# EAGLE design ReflowController (EAGLE 6.3)
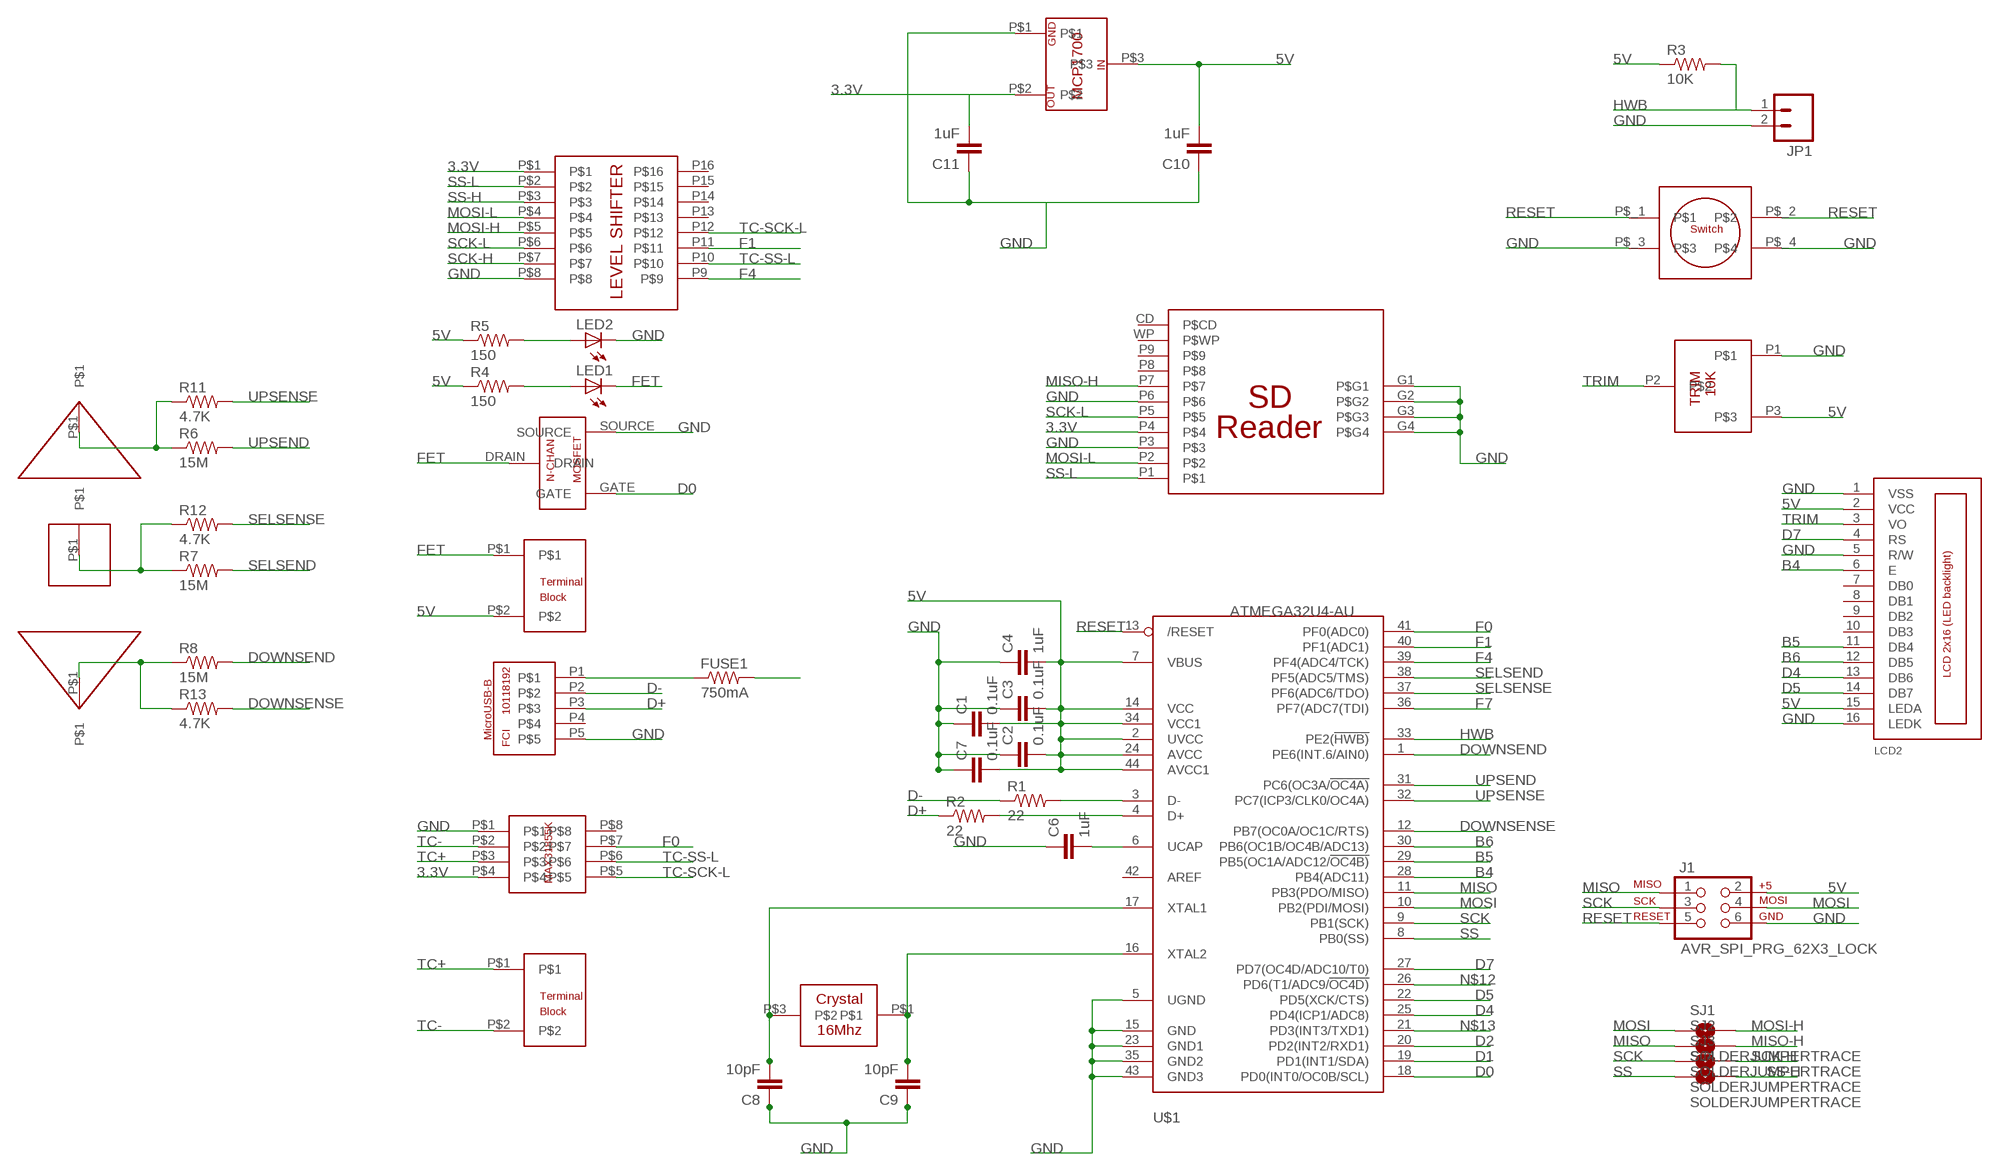
[diagram p0: schematic, sheet 1]

## Parts
C1  0.1uF  CAP0603-CAP  [0603-CAP]
C2  0.1uF  CAP0603-CAP  [0603-CAP]
C3  0.1uF  CAP0603-CAP  [0603-CAP]
C4  1uF  CAP0603-CAP  [0603-CAP]
C6  1uF  CAP0603-CAP  [0603-CAP]
C7  0.1uF  CAP0603-CAP  [0603-CAP]
C8  10pF  CAP0603-CAP  [0603-CAP]
C9  10pF  CAP0603-CAP  [0603-CAP]
C10  1uF  CAP0603-CAP  [0603-CAP]
C11  1uF  CAP0603-CAP  [0603-CAP]
FUSE1  750mA  RESISTOR0603-RES  [0603-RES]
J1  AVR_SPI_PRG_62X3_LOCK  [2X3_LOCK]
JP1  M02PTH  [1X02]
LCD2  LCD_2X16_SIL  [HY-1602F]
LED1  LED0603  [LED-0603]
LED2  LED0603  [LED-0603]
R1  22  RESISTOR0603-RES  [0603-RES]
R2  22  RESISTOR0603-RES  [0603-RES]
R3  10K  RESISTOR0603-RES  [0603-RES]
R4  150  RESISTOR0603-RES  [0603-RES]
R5  150  RESISTOR0603-RES  [0603-RES]
R6  15M  RESISTOR0603-RES  [0603-RES]
R7  15M  RESISTOR0603-RES  [0603-RES]
R8  15M  RESISTOR0603-RES  [0603-RES]
R11  4.7K  RESISTOR0603-RES  [0603-RES]
R12  4.7K  RESISTOR0603-RES  [0603-RES]
R13  4.7K  RESISTOR0603-RES  [0603-RES]
SJ1  SOLDERJUMPERTRACE  [SJ_2S-TRACE]
SJ2  SOLDERJUMPERTRACE  [SJ_2S-TRACE]
SJ3  SOLDERJUMPERTRACE  [SJ_2S-TRACE]
SJ4  SOLDERJUMPERTRACE  [SJ_2S-TRACE]
U$1  ATMEGA32U4-AU  [TQFP44]
U$2  16MHZ-CRYSTAL_NX3225GA-16.000M-STD-CRG-1  [16MHZ-CRYSTAL_NX3225GA-16.000M-STD-CRG-1]
U$3  USB-B_10118192-0001LF  [USB-B_10118192-0001LF]
U$4  SDREADER_2041021-4  [SDREADER_2041021-4]
U$5  2POS_TERM_ED2748-ND  [2POS_TERM_ED2748-ND]
U$6  N-MOSFET630_DMG1012T-7DICT-ND  [N-MOSFET630_DMG1012T-7DICT-ND]
U$7  2POS_TERM_ED2748-ND  [2POS_TERM_ED2748-ND]
U$8  NXP_LVL_SHIFT_74HC4050D,653  [NXP_LVL_SHIFT_74HC4050D,653]
U$9  MAX_TC_MAX31855KASA+  [MAX_TC_MAX31855KASA+]
U$10  10K_TRIM_3362F-1-103LF  [10K_TRIM_3362F-1-103LF]
U$11  MCP1700__LDO  [MCP1700__LDO]
U$12  MOM-SWITCH-EG4620CT-ND  [MOM-SWITCH-EG4620CT-ND]
U$13  CAPTOUCH_ARROW  [CAPTOUCH_ARROW]
U$14  CAPTOUCH_ARROW  [CAPTOUCH_ARROW]
U$15  CAPTOUCH_SQUARE  [CAPTOUCH_SQUARE]

## Nets
3.3V: C11.2 U$4.P4 U$8.P$1 U$9.P$4 U$11.P$2
5V: C1.2 C2.2 C3.2 C4.2 C7.2 C10.2 FUSE1.2 J1.2 LCD2.2(VCC) LCD2.15(LEDA) R3.1 R4.1 R5.1 U$1.2(UVCC) U$1.7(VBUS) U$1.14(VCC) U$1.24(AVCC) U$1.34(VCC1) U$1.44(AVCC1) U$5.P$2 U$10.P3 U$11.P$3
B4: LCD2.6(E) U$1.28(PB4(ADC11))
B5: LCD2.11(DB4) U$1.29(PB5(OC1A/ADC12/!OC4B))
B6: LCD2.12(DB5) U$1.30(PB6(OC1B/OC4B/ADC13))
D0: U$1.18(PD0(INT0/OC0B/SCL)) U$6.GATE
D1: U$1.19(PD1(INT1/SDA))
D2: U$1.20(PD2(INT2/RXD1))
D4: LCD2.13(DB6) U$1.25(PD4(ICP1/ADC8))
D5: LCD2.14(DB7) U$1.22(PD5(XCK/CTS))
D7: LCD2.4(RS) U$1.27(PD7(OC4D/ADC10/T0))
D+: R2.1 U$3.P3
D-: R1.1 U$3.P2
DOWNSEND: R8.2 U$1.1(PE6(INT.6/AIN0))
DOWNSENSE: R13.2 U$1.12(PB7(OC0A/OC1C/RTS))
F0: U$1.41(PF0(ADC0)) U$9.P$7
F1: U$1.40(PF1(ADC1)) U$8.P11
F4: U$1.39(PF4(ADC4/TCK)) U$8.P9
F7: U$1.36(PF7(ADC7(TDI))
FET: LED1.C U$5.P$1 U$6.DRAIN
GND: C1.1 C2.1 C3.1 C4.1 C6.1 C7.1 C8.1 C9.1 C10.1 C11.1 J1.6 JP1.2 LCD2.1(VSS) LCD2.5(R/W) LCD2.16(LEDK) LED2.C U$1.5(UGND) U$1.15(GND) U$1.23(GND1) U$1.35(GND2) U$1.43(GND3) U$3.P5 U$4.G1(P$G1) U$4.G2(P$G2) U$4.G3(P$G3) U$4.G4(P$G4) U$4.P3 U$4.P6 U$6.SOURCE U$8.P$8 U$9.P$1 U$10.P1 U$11.P$1 U$12.P$_3 U$12.P$_4
HWB: JP1.1 R3.2 U$1.33(PE2(!HWB))
MISO: J1.1 SJ2.1 U$1.11(PB3(PDO/MISO))
MISO-H: SJ2.2 U$4.P7
MOSI: J1.4 SJ1.1 U$1.10(PB2(PDI/MOSI))
MOSI-H: SJ1.2 U$8.P$5
MOSI-L: U$4.P2 U$8.P$4
N$1: C8.2 U$1.17(XTAL1) U$2.P$3
N$2: C9.2 U$1.16(XTAL2) U$2.P$1
N$3: LED1.A R4.2
N$4: LED2.A R5.2
N$5: FUSE1.1 U$3.P1
N$7: R1.2 U$1.3(D-)
N$8: C6.2 U$1.6(UCAP)
N$9: R2.2 U$1.4(D+)
N$12: U$1.26(PD6(T1/ADC9/!OC4D))
N$13: U$1.21(PD3(INT3/TXD1))
N$15: R6.1 R11.1 U$13.P$1
N$16: R7.1 R12.1 U$15.P$1
N$17: R8.1 R13.1 U$14.P$1
RESET: J1.5 U$1.13(/RESET) U$12.P$_1 U$12.P$_2
SCK: J1.3 SJ3.1 U$1.9(PB1(SCK))
SCK-H: SJ3.2 U$8.P$7
SCK-L: U$4.P5 U$8.P$6
SELSEND: R7.2 U$1.38(PF5(ADC5/TMS))
SELSENSE: R12.2 U$1.37(PF6(ADC6/TDO))
SS: SJ4.1 U$1.8(PB0(SS))
SS-H: SJ4.2 U$8.P$3
SS-L: U$4.P1 U$8.P$2
TC+: U$7.P$1 U$9.P$3
TC-: U$7.P$2 U$9.P$2
TC-SCK-L: U$8.P12 U$9.P$5
TC-SS-L: U$8.P10 U$9.P$6
TRIM: LCD2.3(VO) U$10.P2
UPSEND: R6.2 U$1.31(PC6(OC3A/!OC4A))
UPSENSE: R11.2 U$1.32(PC7(ICP3/CLK0/OC4A))
Unconnected: LCD2.7(DB0) LCD2.8(DB1) LCD2.9(DB2) LCD2.10(DB3) U$1.42(AREF) U$3.P4 U$4.CD(P$CD) U$4.P8 U$4.P9 U$4.WP(P$WP) U$8.P13 U$8.P14 U$8.P15 U$8.P16 U$9.P$8

## Library data of the parts
C1-C4 C6-C11 = SparkFun-Capacitors:CAP: Capacitor Standard 0603 ceramic capacitor, and 0.1" leaded capacitor.
FUSE1 R1-R8 R11-R13 = SparkFun-Passives:RESISTOR: Resistor Basic schematic elements and footprints for 0603, 1206, and PTH resistors.
J1 = SparkFun-Connectors:AVR_SPI_PRG_6: AVR ISP 6 Pin This is the reduced ISP connector for AVR programming. Common on Arduino. This footprint will take up less PCB space and can be used with a 10-pin to 6-pin adapter such as SKU: BOB-08508
JP1 = SparkFun-Connectors:M02: Header 2 Standard 2-pin 0.1" header. Use with straight break away headers (SKU : PRT-00116), right angle break away headers (PRT-00553), swiss pins (PRT-00743), machine pins (PRT-00117), and female headers (PRT-00115). Molex polarized connector foot print use with SKU : PRT-08233 with associated crimp pins and housings.
LCD2 = lcd_2x16_led_backlight:LCD_2X16_SIL
LED1 LED2 = SparkFun-LED:LED: LEDs Standard schematic elements and footprints for 5mm, 3mm, 1206, and 0603 sized LEDs. 5mm - Spark Fun Electronics SKU : COM-00529 (and others)
SJ1-SJ4 = SparkFun-Passives:SOLDERJUMPER: Solder Jumper Standard SMD solder jumper. Used to automate production. Two varients : Normally Open and Normally Closed are the same, but have different paste layers. NC will have a large amount of paste and should jumper during reflow.
U$1 = adafruit:ATMEGA32U4: http://www.ladyada.net/library/eagle
U$2 = JKCustom:16MHZ-CRYSTAL_NX3225GA-16.000M-STD-CRG-1
U$3 = JKCustom:USB-B_10118192-0001LF
U$4 = JKCustom:SDREADER_2041021-4
U$5 U$7 = JKCustom:2POS_TERM_ED2748-ND
U$6 = JKCustom:N-MOSFET630_DMG1012T-7DICT-ND
U$8 = JKCustom:NXP_LVL_SHIFT_74HC4050D,653
U$9 = JKCustom:MAX_TC_MAX31855KASA+
U$10 = JKCustom:10K_TRIM_3362F-1-103LF
U$11 = JKCustom:MCP1700__LDO
U$12 = JKCustom:MOM-SWITCH-EG4620CT-ND
U$13 U$14 = JKCustom:CAPTOUCH_ARROW
U$15 = JKCustom:CAPTOUCH_SQUARE

## Board
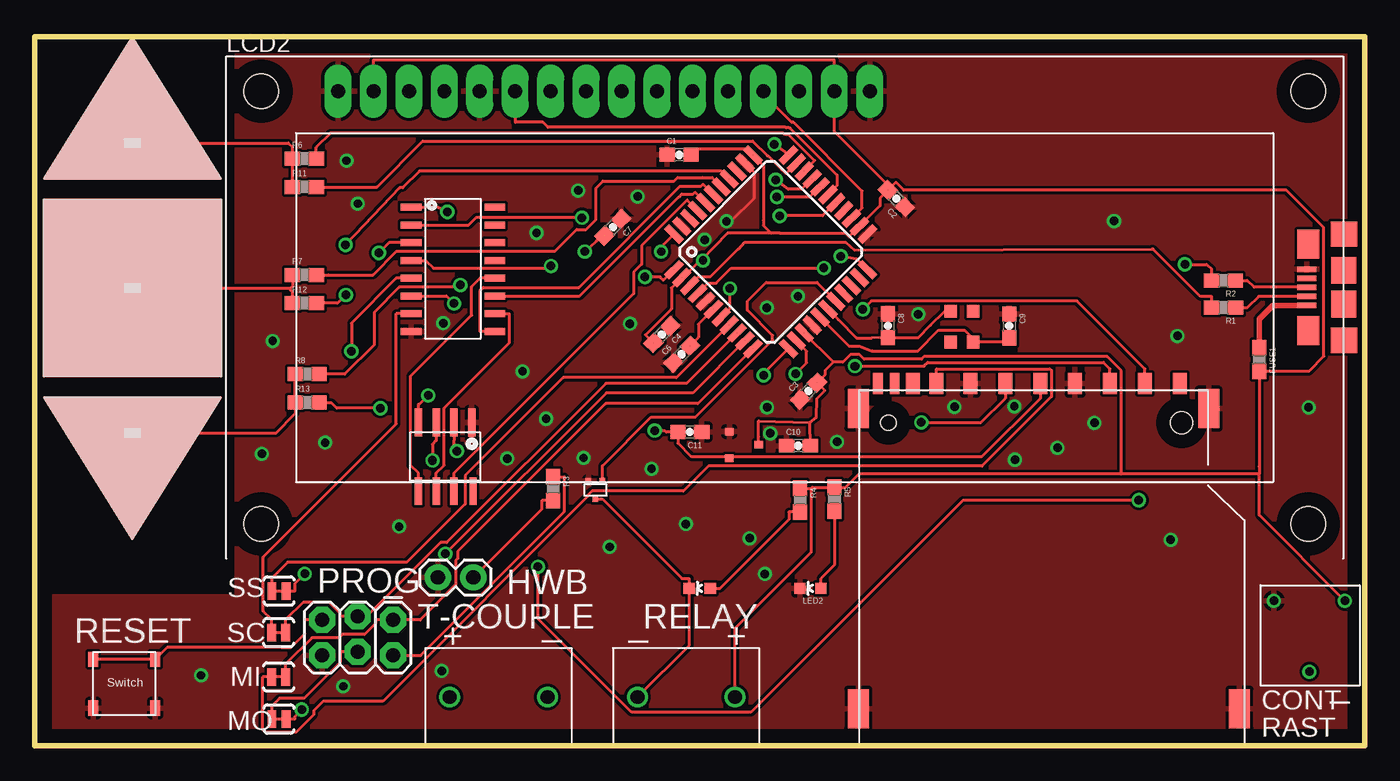
[diagram p1: board, top side]
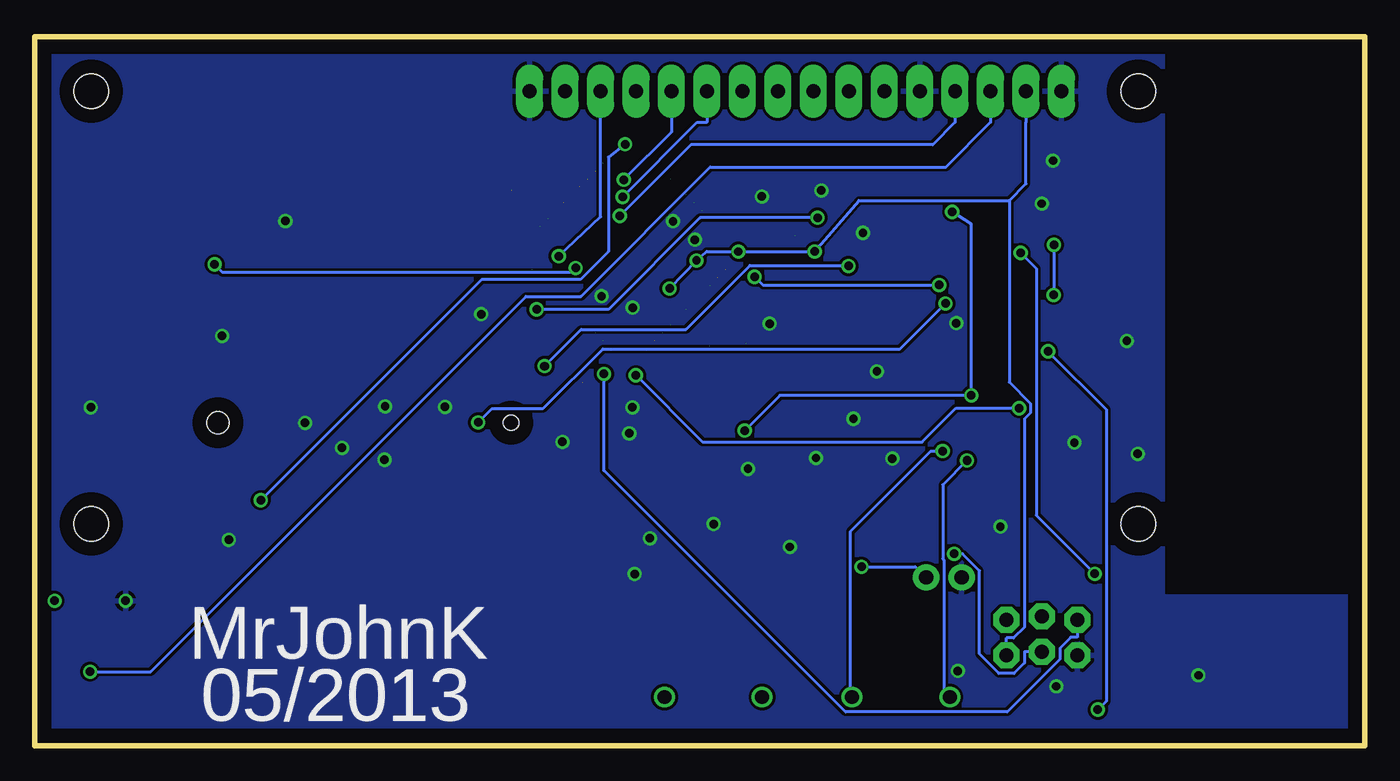
[diagram p2: board, bottom side, seen from below]

Size 95.25 x 50.8 mm. Coordinates in mm from the lower left corner, seen from the top.
Outline: 95.25,0 95.25,50.8 0,50.8 0,0 95.25,0
Copper layers (1*16): Top 0.035mm / dielectric 1.5mm / Bottom 0.035mm
Design rules "default *": minimum track width 8mil, minimum drill 24mil, track to track 8mil, track to pad 8mil, pad to pad 8mil, via to via 8mil, smd to smd 8mil, copper to edge 40mil, drill to drill 8mil, minimum pad ring 8mil, minimum via ring 8mil, stop-mask expansion 4mil, vias tented up to drill 0mil, thermal gap 10mil

### Footprints (pad centres in the part's own frame; a part is rotated, then mirrored left to right if it is on the bottom)
0603-CAP = smd 1.1 x 1: 1 -0.85,0; 2 0.85,0
0603-RES = smd 1.1 x 1: 1 -0.85,0; 2 0.85,0
2X3_LOCK = drill 1.016 pad 1.88 octagon: 1 0,0; 2 0,2.54; 3 2.54,-0.254; 4 2.54,2.286; 5 5.08,0; 6 5.08,2.54
1X02 = drill 1.016 pad 1.88: 1 0,0; 2 2.54,0
HY-1602F = drill 1 pad 1.93 long: 1 2.54,0; 2 5.08,0; 3 7.62,0; 4 10.16,0; 5 12.7,0; 6 15.24,0; 7 17.78,0; 8 20.32,0; 9 22.86,0; 10 25.4,0; 11 27.94,0; 12 30.48,0; 13 33.02,0; 14 35.56,0; 15 38.1,0; 16 40.64,0 | hole 2.5: -2.96,0; 72.04,0; -2.96,-31; 72.04,-31
LED-0603 = smd 0.8 x 0.8: A 0,-0.75; C 0,0.75
SJ_2S-TRACE = smd 0.635 x 1.27: 1 -0.508,0; 2 0.508,0
TQFP44 = smd 1.5 x 0.5: 1 -5.8,4; 2 -5.8,3.2; 3 -5.8,2.4; 4 -5.8,1.6; 5 -5.8,0.8; 6 -5.8,0; 7 -5.8,-0.8; 8 -5.8,-1.6; 9 -5.8,-2.4; 10 -5.8,-3.2; 11 -5.8,-4; 23 5.8,-4; 24 5.8,-3.2; 25 5.8,-2.4; 26 5.8,-1.6; 27 5.8,-0.8; 28 5.8,0; 29 5.8,0.8; 30 5.8,1.6; 31 5.8,2.4; 32 5.8,3.2; 33 5.8,4 | smd 0.5 x 1.5: 12 -4,-5.8; 13 -3.2,-5.8; 14 -2.4,-5.8; 15 -1.6,-5.8; 16 -0.8,-5.8; 17 0,-5.8; 18 0.8,-5.8; 19 1.6,-5.8; 20 2.4,-5.8; 21 3.2,-5.8; 22 4,-5.8; 34 4,5.8; 35 3.2,5.8; 36 2.4,5.8; 37 1.6,5.8; 38 0.8,5.8; 39 0,5.8; 40 -0.8,5.8; 41 -1.6,5.8; 42 -2.4,5.8; 43 -3.2,5.8; 44 -4,5.8
16MHZ-CRYSTAL_NX3225GA-16.000M-STD-CRG-1 = smd 0.9 x 0.9: P$1 -1.1,-0.8; P$3 1.1,0.8; P$NC_2 1.1,-0.8; P$NC_4 -1.1,0.8
USB-B_10118192-0001LF = smd 0.4 x 1.35: P1 -1.3,2.65; P2 -0.65,2.65; P3 0,2.65; P4 0.65,2.65; P5 1.3,2.65 | smd 1.8 x 1.9: P$1_NC -3.8,0; P$2_NC 3.8,0 | smd 1.9 x 1.8: P$3_NC -1.2,0; P$4_NC 1.2,0 | smd 2.1 x 1.6: P$5_NC -3.1,2.55; P$6_NC 3.1,2.55
SDREADER_2041021-4 = smd 0.7 x 1.5: CD -11.05,24.7; WP -12.25,24.7 | smd 1.5 x 2.8: G1 11.45,22.9; G2 13.65,1.4; G3 -13.65,1.4; G4 -13.65,22.9 | smd 1 x 1.5: P1 6.875,24.7; P2 4.375,24.7; P3 1.875,24.7; P4 -0.625,24.7; P5 -3.125,24.7; P6 -5.625,24.7; P7 -8.05,24.7; P8 -9.75,24.7; P9 9.375,24.7 | hole 1.1: -11.5,21.9 | hole 1.6: 9.5,21.9
2POS_TERM_ED2748-ND = drill 1: P$1 0,0; P$2 7,0
N-MOSFET630_DMG1012T-7DICT-ND = smd 0.4 x 0.4: DRAIN 0,1.3; GATE -0.5,0; SOURCE 0.5,0
NXP_LVL_SHIFT_74HC4050D,653 = smd 0.5 x 1.5: P9 8.89,6; P10 7.62,6; P11 6.35,6; P12 5.08,6; P13 3.81,6; P14 2.54,6; P15 1.27,6; P16 0,6; P$1 0,0; P$2 1.27,0; P$3 2.54,0; P$4 3.81,0; P$5 5.08,0; P$6 6.35,0; P$7 7.62,0; P$8 8.89,0
MAX_TC_MAX31855KASA+ = smd 1.98 x 0.53: P$1 0,0; P$2 0,-1.27; P$3 0,-2.54; P$4 0,-3.81; P$5 4.93,-3.81; P$6 4.93,-2.54; P$7 4.93,-1.27; P$8 4.93,0.1
10K_TRIM_3362F-1-103LF = drill 0.6: P1 -2.54,5.08; P2 0,0; P3 2.54,5.08
MCP1700__LDO = smd 0.54 x 0.62: P$1 0,0; P$2 1.9,0; P$3 0.95,2.1
MOM-SWITCH-EG4620CT-ND = smd 0.7 x 1.1: P$_1 -2.225,3.95; P$_2 2.225,3.95; P$_3 -2.225,0.45; P$_4 2.225,0.45
CAPTOUCH_ARROW = smd 1.27 x 0.635: P$1 0,2.54
CAPTOUCH_SQUARE = smd 1.27 x 0.635: P$1 0,0

### Placement (x,y rotation side)
C1  46.15,42.34 0 top
C2  61.71,39.2 135 top
C3  55.42,25.4 45 top
C4  44.91,29.46 225 top
C6  46.33,28.04 45 top
C7  41.4,37.14 225 top
C8  61.1,30.09 270 top
C9  69.79,30.07 270 top
C10  54.7,21.49 0 top
C11  46.92,22.47 180 top
FUSE1  87.71,27.66 270 top
J1  25.66,9.01 180 top
JP1  31.41,12.05 180 top
LCD2  19.17,46.89 0 top
LED1  47.62,11.27 90 top
LED2  55.56,11.27 90 top
R1  85.15,31.39 180 top
R2  85.14,33.33 180 top
R3  37.12,18.41 270 top
R4  54.82,17.59 270 top
R5  57.27,17.66 270 top
R6  19.3,42.06 0 top
R7  19.3,33.73 0 top
R8  19.51,26.62 0 top
R11  19.3,40.03 0 top
R12  19.3,31.7 0 top
R13  19.51,24.59 0 top
SJ1  17.49,1.91 0 top
SJ2  17.46,4.92 180 top
SJ3  17.46,8.1 180 top
SJ4  17.49,11.08 0 top
U$1  52.7,35.37 45 top
U$2  66.41,30.02 90 top
U$3  93.77,32.84 90 top
U$4  72.64,1.24 0 top
U$5  43.15,3.48 0 top
U$6  40.15,18.96 180 top
U$7  29.71,3.48 0 top
U$8  26.94,38.57 270 top
U$9  31.29,23.16 270 top
U$10  91.3,5.3 0 top
U$11  49.74,22.51 270 top
U$12  6.4,2.24 0 top
U$13  6.99,40.64 0 top
U$14  6.99,24.94 180 top
U$15  6.99,32.79 0 top

### Tracks (layer width: path | path; a pad name or v marks a point on that pad's centre or on a via)
3.3V  (via drill 0.61 pad 1.02)
  Top 0.203: v44.4,22.58 45.11,22.58 45.21,22.47 C11.2 46.06,21.67 47.05,20.68 49.74,20.68 | 49.74,20.68 67.81,20.68 72.01,24.89 U$4.P4 | U$11.P$2 49.74,20.68 | U$8.P$1 28,38.57 28.7,38.61 v29.55,38.25 | U$9.P$4 27.48,24.45 27.54,24.45 v28.18,25.09
  Bottom 0.203: v44.4,22.58 41.89,25.09 v28.18,25.09 28.18,37.39 v29.55,38.25
5V  (via drill 0.6, 0.61 pad 1.02)  (8 unrouted)
  Top 0.203: U$10.P3 87.69,16.52 87.69,19.45 | 87.69,19.45 77.81,19.45 | 57.2,27.48 U$1.14 | 77.81,19.45 59.02,19.45 58.08,18.51 R5.1 55.7,18.51 55.62,18.44 | 77.81,19.45 77.81,26.87 76.82,27.87 63.67,27.87 63.51,27.7 59.39,27.7 59.08,28.01 58.41,28.01 57.88,27.48 | 57.88,27.48 | 57.88,27.48 57.2,27.48 | 55.53,23.14 55.98,23.51 56.02,24.87 56.59,25.43 C3.2 56.62,26.61 56.62,26.91 57.2,27.48 | C10.2 55.53,23.14 | U$11.P$3 51.84,22.13 51.84,23.26 55.53,23.14 | R3.1 37.93,19.26 37.93,16.77 27.63,6.47 J1.2 | 60.54,39.23 | 60.54,39.23 60.54,38.68 U$1.24 58.32,36.47 58.06,36.72 53.37,36.72 52.73,36.72 | C7.2 40.45,36.44 40.22,36.17 v39.39,35.4 | LCD2.2 24.25,49.13 57.27,49.13 LCD2.15 57.27,44 61.29,39.98 | 61.29,39.98 61.68,40.37 62.24,39.8 89.66,39.8 92.32,37.13 92.34,27.9 91.25,26.82 FUSE1.2 87.69,26.8 87.69,20 87.69,19.45 | 61.29,39.98 C2.2 60.54,39.23 | U$5.P$2 50.15,8.41 55.62,13.88 55.62,18.44 | R4.1 55.62,18.44 | C4.2 43.74,29.43 45.59,31.29 45.59,32.79 U$1.2 46.44,33.53 47.69,34.78 v47.85,34.77 | C1.2 47.14,42.33 47.55,42.75 50.98,42.75 U$1.34 52.17,41.56 52.17,37.64 52.19,37.64 52.19,37.27 52.73,36.72 | 52.73,36.72 49.62,36.72 47.74,34.78 | U$1.7 49.78,31.32 v49.78,32.77 | U$1.44 44.86,35.73 v44.86,35.4
  Bottom 0.203: 25.45,39.06 25.45,26.04 23.93,24.51 23.93,23.84 24.36,23.41 24.36,8.49 25.14,7.71 25.66,7.71 J1.2 | 25.45,39.06 36.24,39.06 v39.39,35.4 44.45,35.4 | 25.45,39.06 24.25,40.27 24.25,44.66 LCD2.2 | v44.86,35.4 44.45,35.4 | v44.86,35.4 44.45,35.4 | v49.78,32.77 v49.77,32.77 v47.85,34.77 47.14,35.4 v44.86,35.4
B4
  Top 0.203: LCD2.6 34.41,44.66 36.39,44.66 36.74,44.3 53.77,44.3 53.8,44.26 54.02,44.26 54.03,44.25 54.1,44.25 57.29,41.06 57.46,40.88 57.46,40.14 U$1.28
B5  (via drill 0.61 pad 1.02)  (1 unrouted)
  Top 0.203: v53.15,39.31 55.47,39.31 55.49,39.3 U$1.29
  Bottom 0.203: v53.15,39.31 47.81,44.66 47.11,44.66 LCD2.11
B6  (via drill 0.61 pad 1.02)  (1 unrouted)
  Top 0.203: U$1.30 54.93,39.86 53.98,39.86 v53.07,40.55
  Bottom 0.203: LCD2.12 49.65,43.97 v53.07,40.55
D0
  Top 0.203: U$6.GATE 40.65,20.05 44.15,23.54 47.31,23.54 52.84,29.07 52.84,29.39 51.03,31.2 51.03,31.85 52.37,33.18 56.02,33.18 U$1.18
D4  (1 unrouted)
  Top 0.203: U$1.25 59.25,38.52 59.25,39.74 54.33,44.66 54.2,44.66 52.19,46.67 LCD2.13
D5  (via drill 0.61 pad 1.02)  (1 unrouted)
  Top 0.203: U$1.22 58.89,34.85 58.82,34.86 v57.73,35.07
  Bottom 0.203: v57.73,35.07 54.73,37.89 LCD2.14
D7  (via drill 0.61 pad 1.02)  (1 unrouted)
  Top 0.203: U$1.27 56.42,37.96 v53.36,37.96
  Bottom 0.203: v53.36,37.96 v53.35,37.96 48.27,43.05 30.94,43.05 29.33,44.66 LCD2.4
D+
  Top 0.203: R2.1 86.84,33.33 87.33,32.84 U$3.P3
D-
  Top 0.203: R1.1 86.85,31.39 87.65,32.19 U$3.P2
DOWNSEND  (via drill 0.61 pad 1.02)  (1 unrouted)
  Top 0.203: U$1.1 45.03,33.36 44.79,33.59 v43.7,33.59 | v30.47,33 30.32,32.84 26.1,32.84 24.31,31.05 24.31,28.72 22.2,26.62 R8.2
  Bottom 0.203: v43.7,33.59 43.11,33 v30.47,33
DOWNSENSE  (via drill 0.61 pad 1.02)  (1 unrouted)
  Top 0.203: R13.2 21.21,24.59 21.62,24.18 v24.74,24.18 | U$1.12 52.2,26.67 v52.2,26.54
  Bottom 0.203: v52.2,26.54 47.41,21.75 31.7,21.75 29.27,24.18 v24.74,24.18
F0  (1 unrouted)
  Top 0.203: U$1.41 46.72,39.09 43.45,35.82 43.45,34.5 42.88,33.93 42.88,32.39 30.02,19.52 U$9.P$7
F1  (1 unrouted)
  Top 0.203: U$8.P11 39.03,32.22 46.12,39.32 46.33,39.52 47.15,39.52 47.29,39.66 U$1.40
F4  (1 unrouted)
  Top 0.203: U$1.39 47.85,40.22 47.71,40.08 46.21,40.08 38.96,32.83 32.12,32.83 31.89,32.6 31.89,29.68 U$8.P9
FET
  Top 0.203: U$6.DRAIN 40.66,17.66 46.35,11.98 46.88,11.98 LED1.C 46.88,7.2 U$5.P$1
GND  (via drill 0.6)
  Top 0.203: U$1.35 51.5,41.1 51.5,39.21 49.84,37.55 v49.54,37.58
  other vias: 77.31,37.59 63.28,30.92 73.26,21.34 81.35,14.75 81.85,29.36 70.21,20.49 75.9,23.13 65.88,24.28 52.45,24.24 52.43,31.38 42.62,30.24 52.67,22.37 57.47,21.77 39.3,20.62 46.62,15.88 41.17,14.24 44.17,19.83 34.93,26.82 29.25,30.27 35.93,36.74 54.66,32.2 23.12,38.84 47.98,36.25 43.18,39.34 29.14,5.35 11.9,5.04 22.09,4.25 38.92,39.78 17.03,29 52.29,12.3 91.24,24.24 33.83,20.56 36.61,23.42 16.25,20.91 20.79,21.71 26.09,15.7 22.31,41.92 70.17,24.31 51.2,14.86
  pour Top: 0,0 95.25,0 95.25,50.8 14.48,50.8 14.48,10.67 0,10.67
  pour Bottom: 0,0 95.25,0 95.25,50.8 14.48,50.8 14.48,10.67 0,10.67
HWB  (via drill 0.61 pad 1.02)  (1 unrouted)
  Top 0.203: v79.07,17.59 66.49,17.59 51.29,2.39 42.74,2.39 36.03,9.1 v36.03,12.82 | U$1.33 53.98,42.37 v52.97,43.09 | R3.2 36.32,17.56 36.32,16.96 JP1.1
  Bottom 0.203: v36.03,12.82 32.18,12.82 JP1.1 | v52.97,43.09 54.17,42.17 54.17,35.42 56.17,33.41 63.24,33.41 v79.07,17.59
MISO  (1 unrouted)
  Top 0.203: U$1.11 47.49,24.5 40.88,24.5 30.29,13.91 30.29,13.41 30.14,13.26 30.14,11.55 27.59,9.01 J1.1 24.41,9.01 24.41,8.77 23.61,7.97 22.01,7.97 21.79,7.74 19.85,7.74 17.97,5.86 SJ2.1
MISO-H
  Top 0.203: SJ2.2 16.33,4.92 16.33,1.13 16.49,0.97 18.73,0.97 19.97,2.22 19.97,2.51 20.66,3.19 24.93,3.19 39.65,17.91 39.65,17.99 39.9,18.24 46.45,18.24 48.24,20.03 67.85,20.03 72.81,25 72.81,26.88 72.7,27 64.58,27 U$4.P7
MOSI  (via drill 0.61 pad 1.02)  (1 unrouted)
  Top 0.203: U$1.10 47.13,25.28 40.93,25.28 v29.4,13.74 | J1.4 21.88,6.72 21.88,5.98 19.29,3.39 17.52,3.39 16.98,2.85 SJ1.1
  Bottom 0.203: v29.4,13.74 28.8,13.74 27.59,12.53 27.59,6.57 26.2,5.18 25.12,5.18 24.36,5.93 24.36,6.72 J1.4
MOSI-H  (via drill 0.61 pad 1.02)
  Top 0.203: U$8.P$5 25.89,33.49 22.67,30.28 v22.67,28.26 | SJ1.2 18.62,1.91 18.62,2.08 v19.11,2.58
  Bottom 0.203: v22.67,28.26 18.52,24.1 18.52,3.18 v19.11,2.58
MOSI-L  (via drill 0.61 pad 1.02)
  Top 0.203: U$8.P$4 28,34.76 28.55,34.21 36.81,34.21 v36.97,34.37 | U$4.P2 77.01,27 76.55,27.46 63.95,27.46 63.69,27.19 v58.74,27.19
  Bottom 0.203: v58.74,27.19 56.12,29.82 48.62,29.82 44.03,34.4 37,34.4 v36.97,34.37
N$1  (1 unrouted)
  Top 0.203: U$1.17 57.55,30.53 58.85,29.22 59.95,29.22 C8.2 62.75,29.24 63.27,29.24 64.16,30.13 65.15,31.12 U$2.P$3
N$2
  Top 0.203: U$1.16 58.32,28.63 59.06,28.63 59.96,28.28 63.25,28.27 64.74,29.76 66.6,29.76 67.21,29.16 U$2.P$1 69.49,28.92 C9.2
N$3
  Top 0.203: R4.2 54.01,16.74 54.01,16.2 49.08,11.27 LED1.A
N$4
  Top 0.203: LED2.A 56.31,11.98 57.27,12.94 R5.2
N$5
  Top 0.406: FUSE1.1 87.71,30.56 88.69,31.54 U$3.P1
N$7  (1 unrouted)
  Top 0.203: R1.2 84.3,32.19 83.49,32.19 80.1,35.59 80.01,35.59 58.69,35.52 58.07,36.06 57.71,36.06 50.84,36.08 50.38,35.6 50.36,35.58 48.38,33.6 47.54,33.6 U$1.3
N$8  (2 unrouted)
  Top 0.203: C6.2 47.53,29.25 | U$1.6 47.53,30.21 47.53,29.25 | 47.53,29.25
N$9  (via drill 0.61 pad 1.02)
  Top 0.203: R2.2 84.29,34.14 83.94,34.49 v82.38,34.49 | v56.52,34.22 50.44,34.22 49.88,34.22 48.8,33.14 48.21,33.14 U$1.4
  Bottom 0.203: v56.52,34.22 56.84,33.91 81.8,33.91 v82.38,34.49
N$15
  Top 0.203: U$13.P$1 18.14,43.18 18.45,42.87 R6.1 R11.1
N$16
  Top 0.203: R12.1 18.45,32.5 18.32,32.64 18.32,32.79 | 18.32,32.79 18.45,32.93 R7.1 | U$15.P$1 18.32,32.79
N$17
  Top 0.203: U$14.P$1 17.28,22.4 18.66,23.78 R13.1 R8.1
RESET  (via drill 0.61 pad 1.02)  (1 unrouted)
  Top 0.203: J1.5 19.34,9.01 19.34,8.02 18.37,7.06 17.65,7.06 9.49,7.06 U$12.P$_2 U$12.P$_1 | U$1.13 55.29,28.26 55.29,27.43 v54.48,26.63
  Bottom 0.203: v54.48,26.63 54.48,19.71 37.18,2.41 25.6,2.41 21.82,6.18 21.82,6.98 21.05,7.76 20.58,7.76 J1.5
SCK  (1 unrouted)
  Top 0.203: U$1.9 46.68,25.96 40.91,25.96 29.51,14.56 29.06,14.56 23.77,9.26 J1.3 21.88,9.26 21.88,9.48 21.09,10.27 19.2,10.27 17.97,9.04 SJ3.1
SCK-H
  Top 0.203: SJ3.2 16.95,9.04 16.36,9.63 16.36,13.52 25.89,23.05 25.89,30.95 U$8.P$7
SCK-L  (via drill 0.61 pad 1.02)
  Top 0.203: U$8.P$6 29.48,32.22 v30.02,31.68 | U$4.P5 69.51,24.89 67.78,23.16 v63.5,23.16
  Bottom 0.203: v63.5,23.16 62.51,24.14 58.85,24.14 54.57,28.43 33.27,28.43 v30.02,31.68
SELSEND
  Top 0.203: R7.2 21.01,33.73 24.21,33.73 25.9,35.42 37.24,35.42 38.8,36.98 39.49,36.98 40.19,37.68 40.19,39.95 40.7,40.46 45.79,40.46 46.04,40.7 47.84,40.7 48.5,40.7 U$1.38
SELSENSE  (via drill 0.6)  (1 unrouted)
  Top 0.203: v22.25,35.88 26.14,39.98 26.35,39.98 27.54,41.17 49.17,41.17 U$1.37 | v22.27,32.3 21.68,31.7 R12.2
  Bottom 0.203: v22.25,35.88 22.27,35.88 v22.27,32.3
SS  (1 unrouted)
  Top 0.203: SJ4.1 16.98,12.02 18.09,13.13 26.64,13.13 30.82,17.31 30.82,19.35 37.83,26.36 45.96,26.36 U$1.8
SS-H  (via drill 0.61 pad 1.02)
  Top 0.203: SJ4.2 18.62,11.08 18.62,11.61 v19.33,12.32 | U$8.P$3 25.36,36.03 v24.64,35.31
  Bottom 0.203: v24.64,35.31 23.52,34.19 23.52,16.51 v19.33,12.32
SS-L  (via drill 0.61 pad 1.02)
  Top 0.203: v59.31,31.26 59.92,31.86 74.65,31.86 79.51,27 U$4.P1 | v39.19,37.83 39.17,37.86 31.64,37.86 31.08,37.3 28,37.3 U$8.P$2
  Bottom 0.203: v39.19,37.83 47.59,37.83 54.16,31.26 v59.31,31.26
TC+  (via drill 0.61 pad 1.02)
  Top 0.203: U$9.P$3 28.75,21.86 28.48,21.59 v28.48,20.43
  Bottom 0.203: v28.48,20.43 30.22,18.69 30.22,13.39 30.14,13.3 30.14,3.91 U$7.P$1
TC-  (via drill 0.61 pad 1.02)
  Top 0.203: U$9.P$2 30.02,21.86 30.02,21.32 v30.23,21.1
  Bottom 0.203: U$7.P$2 36.84,3.61 36.84,15.34 31.08,21.1 v30.23,21.1
TC-SCK-L
  Top 0.203: U$8.P12 31.89,33.49 31.29,32.89 31.29,30.85 26.91,26.47 26.91,20.09 27.48,19.52 U$9.P$5
TC-SS-L
  Top 0.203: U$8.P10 34,30.95 34,28.87 29.32,24.19 29.32,20.09 28.75,19.52 U$9.P$6
TRIM
  Bottom 0.203: LCD2.3 26.79,44.66 29.98,41.46 46.88,41.46 56.15,32.19 60.08,32.19 86.97,5.3 U$10.P2
UPSEND  (1 unrouted)
  Top 0.203: R6.2 20.15,42.87 21.18,43.9 53.6,43.9 53.7,43.79 53.98,43.79 55.85,41.92 U$1.31
UPSENSE  (1 unrouted)
  Top 0.203: R11.2 24.5,40.03 27.79,43.32 51.41,43.32 52.46,42.27 52.51,42.27 53.51,41.27 53.52,41.27 53.8,40.99 U$1.32

### Text on the board
_tsilk: SS | PROG | HWB | T-COUPLE | RELAY | RESET | SC | _ | _ | + | + | MI | _ | CONT | MO | RAST
_bsilk: MrJohnK | 05/2013